# Altium schematic sheet Flight Controller 2.SchDoc
size 297 x 209 mm
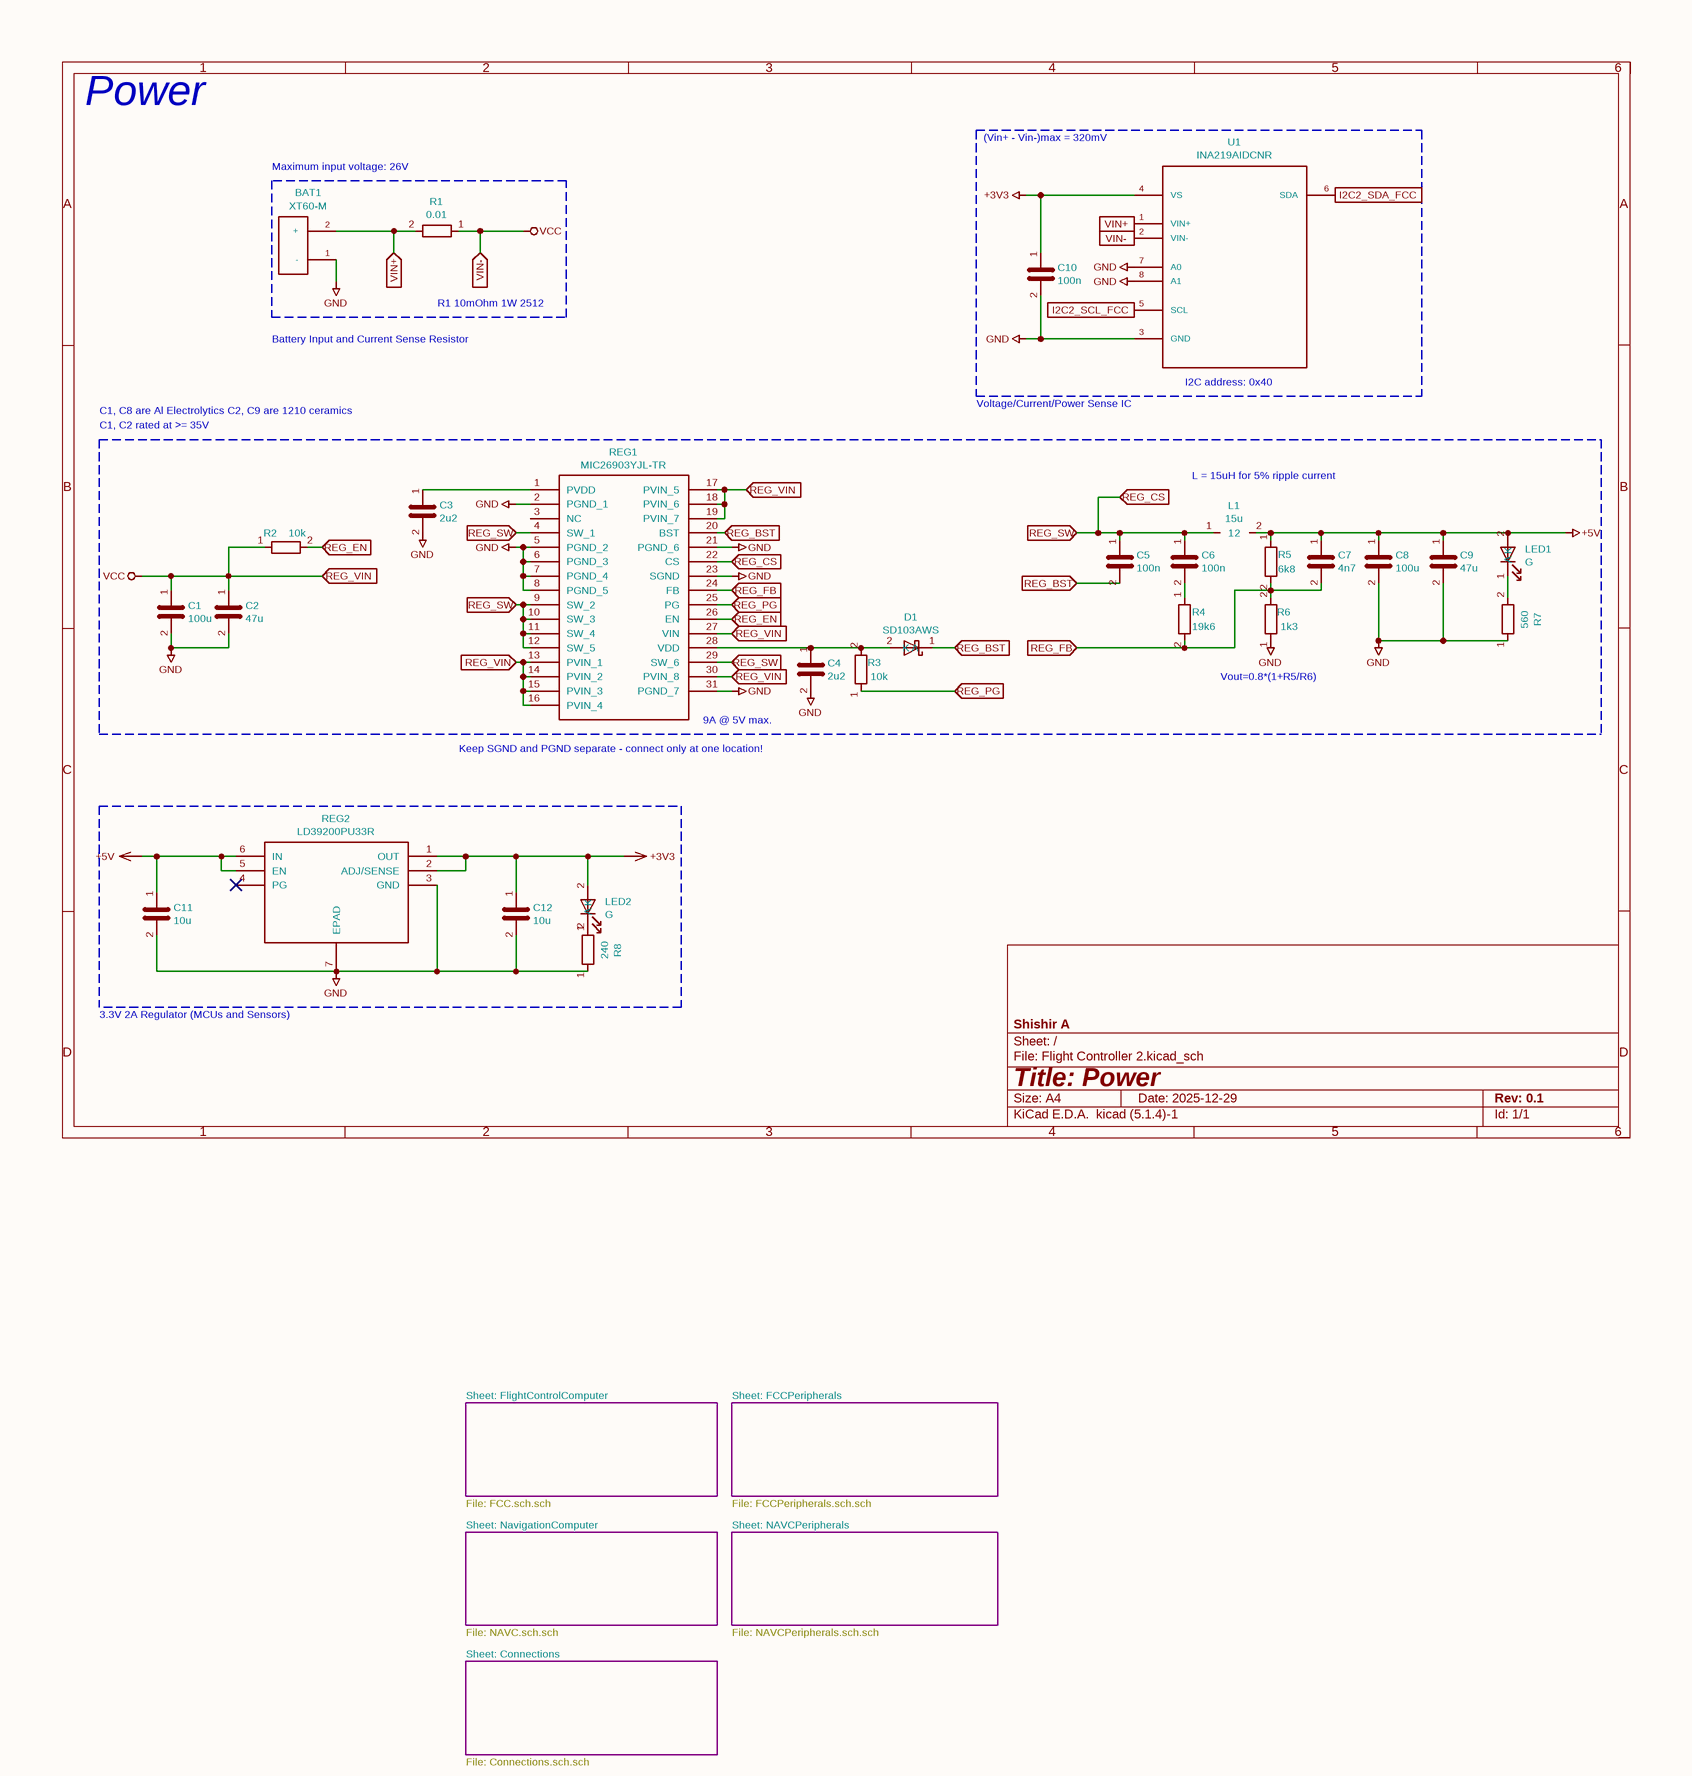
[diagram p0: Flight Controller 2.SchDoc]

## Parts
BAT1  XT60-M  [AMASS_XT60-M]
C1  100u  [C_Elec_6.3x7.7]
C2  47u  [C_1210_3225Metric]
C3  2u2  [C_0805_2012Metric]
C4  2u2  [C_0805_2012Metric]
C5  100n  [C_0805_2012Metric]
C6  100n  [C_0805_2012Metric]
C7  4n7  [C_0805_2012Metric]
C8  100u  [C_Elec_6.3x7.7]
C9  47u  [C_1210_3225Metric]
C10  100n  [C_0402_1005Metric]
C11  10u  [C_0603_1608Metric]
C12  10u  [C_0603_1608Metric]
D1  SD103AWS  [D_SOD-323]
L1  15u  [INDPM135125X650N]
LED1  G  [LED_0603_1608Metric]
LED2  G  [LED_0603_1608Metric]
R1  0.01  [R_2512_6332Metric]
R2  10k  [R_0805_2012Metric]
R3  10k  [R_0805_2012Metric]
R4  19k6  [R_0805_2012Metric]
R5  6k8  [R_0805_2012Metric]
R6  1k3  [R_0805_2012Metric]
R7  560  [R_0603_1608Metric]
R8  240  [R_0603_1608Metric]
REG1  MIC26903YJL-TR  [MIC24054YJLTR]
REG2  LD39200PU33R  [SON95P300X300X100-7N-D]
U1  INA219AIDCNR  [SOT65P280X145-8N]

## Sub-sheets
Connections = Connections.SchDoc: no entries
FCCPeripherals = FCCPeripherals.SchDoc: no entries
FlightControlComputer = FCC.SchDoc: no entries
NAVCPeripherals = NAVCPeripherals.SchDoc: no entries
NavigationComputer = NAVC.SchDoc: no entries

## Ports
I2C2_SCL_FCC (in), I2C2_SDA_FCC (in), REG_BST (in), REG_CS (in), REG_EN (in), REG_FB (in), REG_PG (in), REG_SW (in), REG_VIN (in), VIN+ (in), VIN- (in)

## Nets
+3V3: C10.1 C12.1 LED2.2(A) REG2.1(OUT) REG2.2(ADJ/SENSE) U1.4(VS)
+5V: C7.1 C8.1 C9.1 C11.1 L1.2 LED1.2(A) R5.1 REG2.5(EN) REG2.6(IN)
GND: BAT1.1(-) C1.2 C2.2 C3.2 C4.2 C8.2 C9.2 C10.2 C11.2 C12.2 R6.1 R7.1 R8.1 REG1.2(PGND_1) REG1.5(PGND_2) REG1.6(PGND_3) REG1.7(PGND_4) REG1.8(PGND_5) REG1.21(PGND_6) REG1.23(SGND) REG1.31(PGND_7) REG2.3(GND) REG2.7(EPAD) U1.3(GND) U1.7(A0) U1.8(A1)
VCC: C1.1 C2.1 R1.1 R2.1 REG1.13(PVIN_1) REG1.14(PVIN_2) REG1.15(PVIN_3) REG1.16(PVIN_4) REG1.17(PVIN_5) REG1.18(PVIN_6) REG1.19(PVIN_7) REG1.27(VIN) REG1.30(PVIN_8) U1.2(VIN-) ; port REG_VIN, port VIN-
I2C2_SCL_FCC: U1.5(SCL) ; port I2C2_SCL_FCC
I2C2_SDA_FCC: U1.6(SDA) ; port I2C2_SDA_FCC
REG_BST: C5.2 D1.1(K) REG1.20(BST) ; port REG_BST
REG_CS: C5.1 C6.1 L1.1 REG1.4(SW_1) REG1.9(SW_2) REG1.10(SW_3) REG1.11(SW_4) REG1.12(SW_5) REG1.22(CS) REG1.29(SW_6) ; port REG_SW, port REG_CS
REG_EN: R2.2 REG1.26(EN) ; port REG_EN
REG_FB: C7.2 R4.2 R5.2 R6.2 REG1.24(FB) ; port REG_FB
REG_PG: R3.1 REG1.25(PG) ; port REG_PG
VIN+: BAT1.2(+) R1.2 U1.1(VIN+) ; port VIN+
NetC3_1: C3.1 REG1.1(PVDD)
NetC4_1: C4.1 D1.2(A) R3.2 REG1.28(VDD)
NetC6_2: C6.2 R4.1
NetLED1_1: LED1.1(K) R7.2
NetLED2_1: LED2.1(K) R8.2

Not connected (* = marked no-connect by the designer): REG1 3(NC); REG2 4(PG)*

## Notes on the sheet
- Power
- (Vin+ - Vin-)max = 320mV
- Maximum input voltage: 26V
- Battery Input and
  Current Sense Resistor
- R1 10mOhm 1W 2512
- C1, C8 are Al Electrolytics
  C2, C9 are 1210 ceramics
- C1, C2 rated at >= 35V
- Voltage/Current/Power Sense IC
- (near U1) I2C address: 0x40
- L = 15uH for 5% ripple current
- Vout=0.8*(1+R5/R6)
- (near REG1) Keep SGND and PGND separate - connect only at one location!
- (near REG1) 9A @ 5V max.
- 3.3V 2A Regulator (MCUs and Sensors)
- Sheet: FlightControlComputer
- Sheet: FCCPeripherals
- File: FCC.sch.sch
- File: FCCPeripherals.sch.sch
- Sheet: NavigationComputer
- Sheet: NAVCPeripherals
- Sheet: Connections
- File: NAVC.sch.sch
- File: NAVCPeripherals.sch.sch
- File: Connections.sch.sch
- 1
- 2
- 3
- 4
- 5
- 6
- A
- B
- C
- D
- Title: Power
- File: Flight Controller 2.kicad_sch
- Sheet: /
- Shishir A
- KiCad E.D.A.  kicad (5.1.4)-1
- Size: A4
- Date: 2025-12-29
- Rev: 0.1
- Id: 1/1

## Library data of the parts
BAT1 = XT60-M_2: Field4: None; Field6: Unavailable; Field7: AMASS; Field5: XT60-M; Value: XT60-M; Footprint: XT60-M:AMASS_XT60-M
C1-C12 = C
  C1: Value: 100u; Footprint: Capacitor_SMD:C_Elec_6.3x7.7; Supplier 1: DigiKey; Supplier Part Number 1: P124788CT-ND
  C2: Value: 47u; Footprint: Capacitor_SMD:C_1210_3225Metric; Supplier 1: DigiKey; Supplier Part Number 1: 587-6141-1-ND
  C3 C4: Value: 2u2; Footprint: Capacitor_SMD:C_0805_2012Metric
  C5 C6: Value: 100n; Footprint: Capacitor_SMD:C_0805_2012Metric
  C7: Value: 4n7; Footprint: Capacitor_SMD:C_0805_2012Metric
  C8: Value: 100u; Footprint: Capacitor_SMD:C_Elec_6.3x7.7
  C9: Value: 47u; Footprint: Capacitor_SMD:C_1210_3225Metric
  C10: Value: 100n; Footprint: Capacitor_SMD:C_0402_1005Metric
  C11 C12: Value: 10u; Footprint: Capacitor_SMD:C_0603_1608Metric
D1 = D_Schottky: Value: SD103AWS; Footprint: Diode_SMD:D_SOD-323
L1 = L: Value: 15u; Footprint: SRP1265A-150M:INDPM135125X650N; Supplier: DigiKey; Supplier Part Number: SRP1265A-150MCT-ND; Supplier 1: DigiKey; Supplier Part Number 1: SRP1265A-150MCT-ND
LED1 LED2 = LED: Value: G; Footprint: LED_SMD:LED_0603_1608Metric
R1-R8 = R
  R1: Value: 0.01; Footprint: Resistor_SMD:R_2512_6332Metric
  R2 R3: Value: 10k; Footprint: Resistor_SMD:R_0805_2012Metric
  R4: Value: 19k6; Footprint: Resistor_SMD:R_0805_2012Metric
  R5: Value: 6k8; Footprint: Resistor_SMD:R_0805_2012Metric
  R6: Value: 1k3; Footprint: Resistor_SMD:R_0805_2012Metric
  R7: Value: 560; Footprint: Resistor_SMD:R_0603_1608Metric
  R8: Value: 240; Footprint: Resistor_SMD:R_0603_1608Metric
REG1 = MIC26903YJL-TR: Manufacturer_Name: Micrel; Description: Switching Voltage Regulators 28V, 9A HyperLight Load  Synchronous DC/DC Buck Regulator SuperSwitcher IIG; Height: 2; Manufacturer_Part_Number: MIC26903YJL-TR; Mouser Part Number: 998-MIC26903YJLTR; Mouser Price/Stock: https://www.mouser.com/Search/Refine.aspx?Keyword=998-MIC26903YJLTR; Value: MIC26903YJL-TR; Footprint: MIC26903YJL-TR:MIC24054YJLTR
REG2 = LD39200PU33R: Manufacturer_Name: STMicroelectronics; Description: LDO Voltage Regulators 2 A high PSRR ultra low drop linear regulator with reverse current protection; Height: 1; Manufacturer_Part_Number: LD39200PU33R; Mouser Part Number: 511-LD39200PU33R; Mouser Price/Stock: https://www.mouser.com/Search/Refine.aspx?Keyword=511-LD39200PU33R; Value: LD39200PU33R; Footprint: LD39200PU33R:SON95P300X300X100-7N-D
U1 = INA219AIDCNR_2: Field4: 26-V, Bi-Directional, Zero-Drift, High-Side, I2C Out Current/Power Monitor 8-SOT-23 -40 to 125; Field5: Texas Instruments; Field6: SOT-23 Texas Instruments; Field7: None; Field8: INA219AIDCNR; Value: INA219AIDCNR; Footprint: INA219AIDCNR:SOT65P280X145-8N